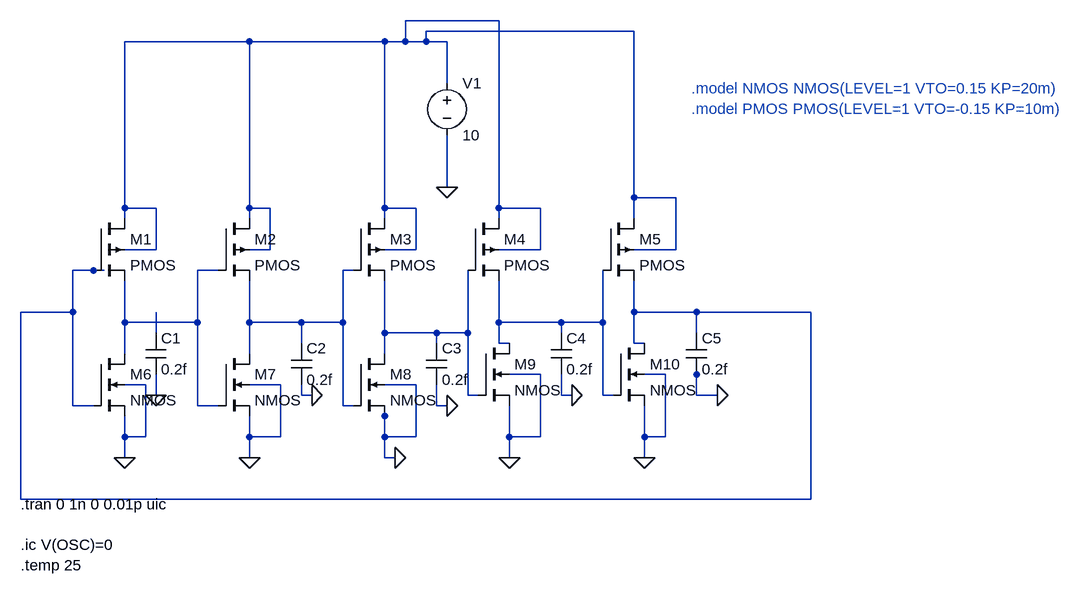
[diagram p0: schematic ltspice.asc]
ltspice.asc, the LTspice schematic file:
Version 4.1
SHEET 1 1148 680
WIRE 256 -464 112 -464
WIRE 464 -448 144 -448
WIRE -128 -432 -320 -432
WIRE 80 -432 -128 -432
WIRE 112 -432 112 -464
WIRE 112 -432 80 -432
WIRE 144 -432 144 -448
WIRE 144 -432 112 -432
WIRE 176 -432 144 -432
WIRE 176 -368 176 -432
WIRE 176 -208 176 -288
WIRE 464 -192 464 -448
WIRE 528 -192 464 -192
WIRE -320 -176 -320 -432
WIRE -272 -176 -320 -176
WIRE -128 -176 -128 -432
WIRE -96 -176 -128 -176
WIRE 80 -176 80 -432
WIRE 128 -176 80 -176
WIRE 256 -176 256 -464
WIRE 320 -176 256 -176
WIRE -320 -160 -320 -176
WIRE -128 -160 -128 -176
WIRE 80 -160 80 -176
WIRE 256 -160 256 -176
WIRE 464 -160 464 -192
WIRE -272 -112 -272 -176
WIRE -272 -112 -320 -112
WIRE -96 -112 -96 -176
WIRE -96 -112 -128 -112
WIRE 128 -112 128 -176
WIRE 128 -112 80 -112
WIRE 320 -112 320 -176
WIRE 320 -112 256 -112
WIRE 528 -112 528 -192
WIRE 528 -112 464 -112
WIRE -368 -80 -400 -80
WIRE -352 -80 -368 -80
WIRE -176 -80 -208 -80
WIRE 32 -80 16 -80
WIRE -400 -16 -400 -80
WIRE -400 -16 -480 -16
WIRE 464 -16 464 -64
WIRE 560 -16 464 -16
WIRE 736 -16 560 -16
WIRE -320 0 -320 -64
WIRE -208 0 -208 -80
WIRE -208 0 -320 0
WIRE -128 0 -128 -64
WIRE -48 0 -128 0
WIRE 16 0 16 -80
WIRE 16 0 -48 0
WIRE 256 0 256 -64
WIRE 352 0 256 0
WIRE 416 0 416 -80
WIRE 416 0 352 0
WIRE -272 16 -272 -16
WIRE 80 16 80 -64
WIRE 160 16 80 16
WIRE 208 16 208 -80
WIRE 208 16 160 16
WIRE 352 16 352 0
WIRE 560 16 560 -16
WIRE -48 32 -48 0
WIRE 160 32 160 16
WIRE 256 32 256 0
WIRE 272 32 256 32
WIRE 464 32 464 -16
WIRE 480 32 464 32
WIRE -320 48 -320 0
WIRE -128 48 -128 0
WIRE 80 48 80 16
WIRE 320 80 272 80
WIRE 512 80 480 80
WIRE 560 80 560 64
WIRE -288 96 -320 96
WIRE -80 96 -128 96
WIRE 128 96 80 96
WIRE -272 112 -272 80
WIRE -48 112 -48 96
WIRE -32 112 -48 112
WIRE 208 112 208 16
WIRE 224 112 208 112
WIRE 352 112 352 80
WIRE 368 112 352 112
WIRE 416 112 416 0
WIRE 432 112 416 112
WIRE 560 112 560 80
WIRE 592 112 560 112
WIRE -400 128 -400 -16
WIRE -368 128 -400 128
WIRE -208 128 -208 0
WIRE -176 128 -208 128
WIRE 16 128 16 0
WIRE 32 128 16 128
WIRE 160 128 160 96
WIRE 176 128 160 128
WIRE 80 144 80 128
WIRE -320 176 -320 144
WIRE -288 176 -288 96
WIRE -288 176 -320 176
WIRE -128 176 -128 144
WIRE -80 176 -80 96
WIRE -80 176 -128 176
WIRE 80 176 80 144
WIRE 128 176 128 96
WIRE 128 176 80 176
WIRE 272 176 272 128
WIRE 320 176 320 80
WIRE 320 176 272 176
WIRE 480 176 480 128
WIRE 512 176 512 80
WIRE 512 176 480 176
WIRE -320 208 -320 176
WIRE -128 208 -128 176
WIRE 80 208 80 176
WIRE 96 208 80 208
WIRE 272 208 272 176
WIRE 480 208 480 176
WIRE -480 272 -480 -16
WIRE 736 272 736 -16
WIRE 736 272 -480 272
FLAG 176 -208 0
FLAG -320 208 0
FLAG -128 208 0
FLAG 96 208 0
FLAG 272 208 0
FLAG 480 208 0
FLAG 592 112 0
FLAG 368 112 0
FLAG 176 128 0
FLAG -32 112 0
FLAG -272 112 0
SYMBOL voltage 176 -384 R0
WINDOW 123 0 0 Left 0
WINDOW 39 0 0 Left 0
SYMATTR InstName V1
SYMATTR Value 10
SYMBOL pmos4 -368 -160 R0
SYMATTR InstName M1
SYMBOL pmos4 -176 -160 R0
SYMATTR InstName M2
SYMBOL pmos4 32 -160 R0
SYMATTR InstName M3
SYMBOL pmos4 208 -160 R0
SYMATTR InstName M4
SYMBOL pmos4 416 -160 R0
SYMATTR InstName M5
SYMBOL nmos4 -368 48 R0
SYMATTR InstName M6
SYMBOL nmos4 -176 48 R0
SYMATTR InstName M7
SYMBOL nmos4 32 48 R0
SYMATTR InstName M8
SYMBOL nmos4 224 32 R0
SYMATTR InstName M9
SYMBOL nmos4 432 32 R0
SYMATTR InstName M10
SYMBOL cap -288 16 R0
SYMATTR InstName C1
SYMATTR Value 0.2f
SYMBOL cap -64 32 R0
SYMATTR InstName C2
SYMATTR Value 0.2f
SYMBOL cap 144 32 R0
SYMATTR InstName C3
SYMATTR Value 0.2f
SYMBOL cap 336 16 R0
SYMATTR InstName C4
SYMATTR Value 0.2f
SYMBOL cap 544 16 R0
SYMATTR InstName C5
SYMATTR Value 0.2f
TEXT -480 280 Left 2 !.tran 0 1n 0 0.01p uic\n\n.ic V(OSC)=0\n.temp 25
TEXT 552 -360 Left 2 ;.model NMOS NMOS(LEVEL=1 VTO=0.15 KP=20m)\n.model PMOS PMOS(LEVEL=1 VTO=-0.15 KP=10m)

The netlist it stands for:
* ltspice.asc
V1 N001 0 10
M1 N001 N002 N003 N001 PMOS
M2 N001 N003 N004 N001 PMOS
M3 N001 N004 N007 N001 PMOS
M4 N001 N007 N005 N001 PMOS
M5 N001 N005 N002 N001 PMOS
M6 N003 N002 0 0 NMOS
M7 N004 N003 0 0 NMOS
M8 N007 N004 0 0 NMOS
M9 N005 N007 0 0 NMOS
M10 N002 N005 0 0 NMOS
C1 N006 0 0.2f
C2 N004 0 0.2f
C3 N007 0 0.2f
C4 N005 0 0.2f
C5 N002 0 0.2f
.model NMOS NMOS
.model PMOS PMOS
.lib standard.mos
.tran 0 1n 0 0.01p uic
.ic V(OSC)=0
.temp 25
* .model NMOS NMOS(LEVEL=1 VTO=0.15 KP=20m)
* .model PMOS PMOS(LEVEL=1 VTO=-0.15 KP=10m)
.backanno
.end